# Altium schematic sheet LTC6804-2_8S+TR.SchDoc
size A4; SheetNumber: 5; SheetTotal: 8
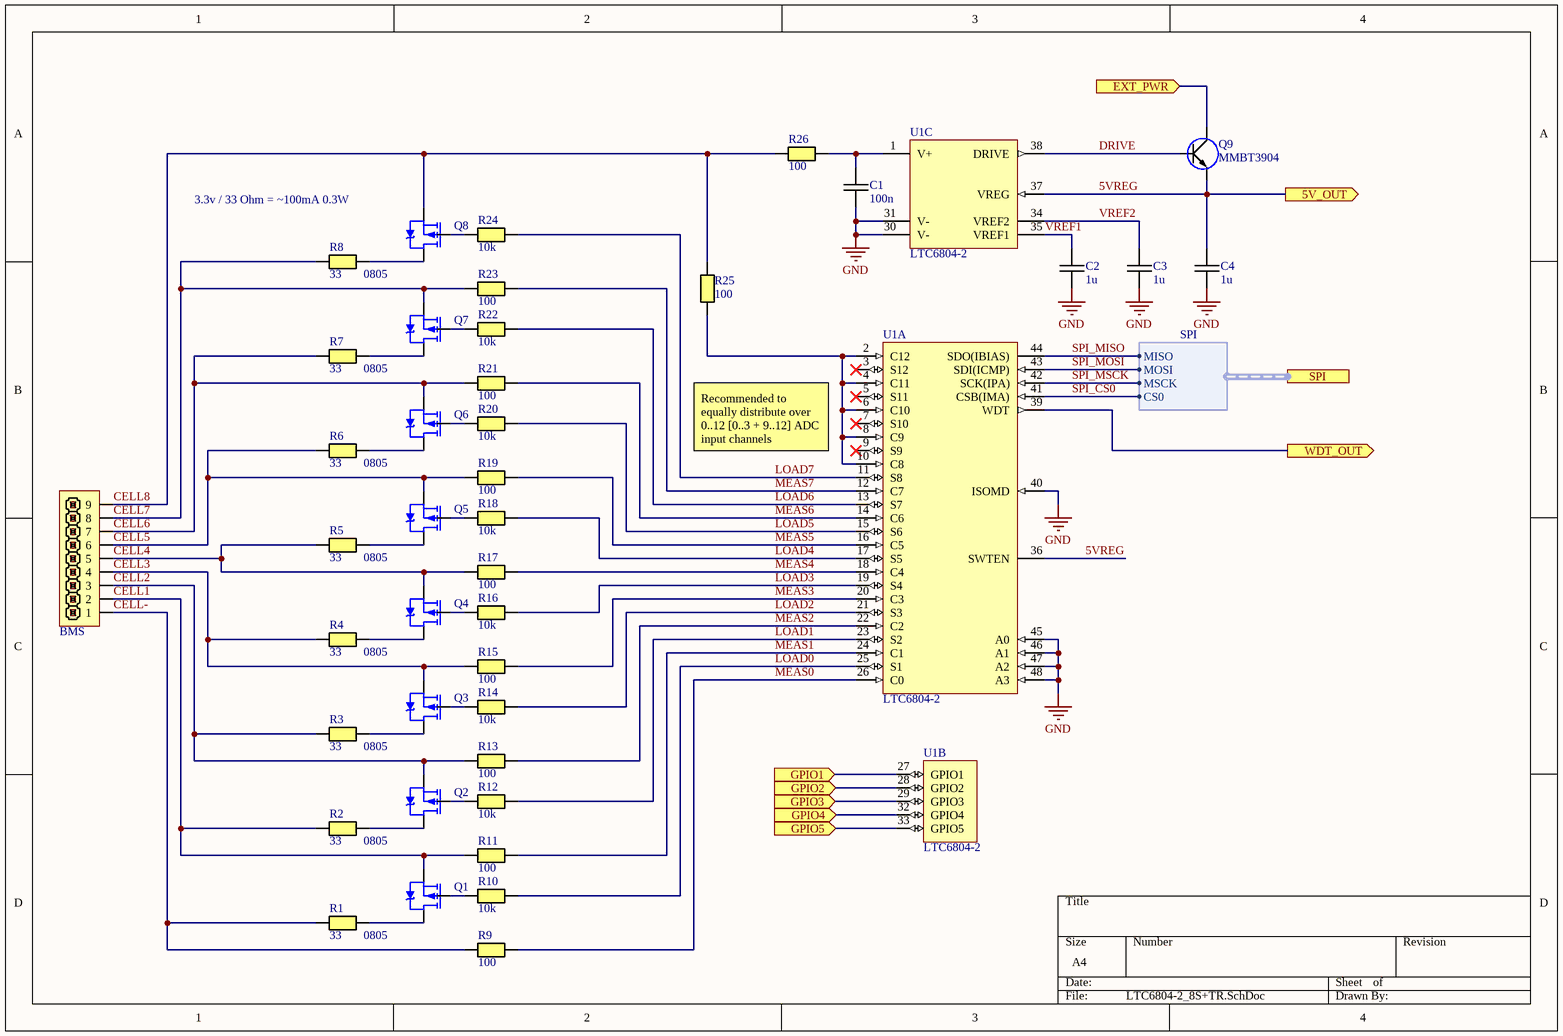
[diagram p0: LTC6804-2_8S+TR.SchDoc]

## Parts
BMS  PIN HEADER 1x9  [XH2.54 9P]  (value not drawn)
C1  100n  [CAPC0603(1608)55_N]
C2  1u  [CAPC0805(2012)75_N]
C3  1u  [CAPC0805(2012)75_N]
C4  1u  [CAPC0805(2012)75_N]
Q1  BSS308PE  [SOT23]  (value not drawn)
Q2  BSS308PE  [SOT23]  (value not drawn)
Q3  BSS308PE  [SOT23]  (value not drawn)
Q4  BSS308PE  [SOT23]  (value not drawn)
Q5  BSS308PE  [SOT23]  (value not drawn)
Q6  BSS308PE  [SOT23]  (value not drawn)
Q7  BSS308PE  [SOT23]  (value not drawn)
Q8  BSS308PE  [SOT23]  (value not drawn)
Q9  MMBT3904  [SOT23]
R1  pack: 0805  [RESC0805(2012)_N]  (hidden comment: 33)
R2  pack: 0805  [RESC0805(2012)_N]  (hidden comment: 33)
R3  pack: 0805  [RESC0805(2012)_N]  (hidden comment: 33)
R4  pack: 0805  [RESC0805(2012)_N]  (hidden comment: 33)
R5  pack: 0805  [RESC0805(2012)_N]  (hidden comment: 33)
R6  pack: 0805  [RESC0805(2012)_N]  (hidden comment: 33)
R7  pack: 0805  [RESC0805(2012)_N]  (hidden comment: 33)
R8  pack: 0805  [RESC0805(2012)_N]  (hidden comment: 33)
R9  100  [RESC0603(1608)_N]
R10  10k  [RESC0603(1608)_N]
R11  100  [RESC0603(1608)_N]
R12  10k  [RESC0603(1608)_N]
R13  100  [RESC0603(1608)_N]
R14  10k  [RESC0603(1608)_N]
R15  100  [RESC0603(1608)_N]
R16  10k  [RESC0603(1608)_N]
R17  100  [RESC0603(1608)_N]
R18  10k  [RESC0603(1608)_N]
R19  100  [RESC0603(1608)_N]
R20  10k  [RESC0603(1608)_N]
R21  100  [RESC0603(1608)_N]
R22  10k  [RESC0603(1608)_N]
R23  100  [RESC0603(1608)_N]
R24  10k  [RESC0603(1608)_N]
R25  100  [RESC0603(1608)_N]
R26  100  [RESC0603(1608)_N]
U1  LTC6804-2  [SSOP48]  (parts A,B,C of 3)

## Ports
5V_OUT (out), EXT_PWR (in), GPIO1 (in), GPIO2 (in), GPIO3 (in), GPIO4 (in), GPIO5 (in), SPI (harness SPI), WDT_OUT (out)

## Harnesses
SPI: MSCK, MOSI, MISO, CS0

## Nets
GND: C1.2 C2.2 C3.2 C4.2 U1.30(V-) U1.31(V-) U1.40(ISOMD) U1.45(A0) U1.46(A1) U1.47(A2) U1.48(A3)
5VREG: C4.1 Q9.2(E) U1.36(SWTEN) U1.37(VREG) ; port 5V_OUT
CELL1: BMS.2 Q1.2 R2.1 R11.1
CELL2: BMS.3 Q2.2 R3.1 R13.1
CELL3: BMS.4 Q3.2 R4.1 R15.1
CELL4: BMS.5 Q4.2 R5.1 R17.1
CELL5: BMS.6 Q5.2 R6.1 R19.1
CELL6: BMS.7 Q6.2 R7.1 R21.1
CELL7: BMS.8 Q7.2 R8.1 R23.1
CELL8: BMS.9 Q8.2 R25.1 R26.1
CELL-: BMS.1 R1.1 R9.1
DRIVE: Q9.1(B) U1.38(DRIVE)
EXT_PWR: Q9.3(C) ; port EXT_PWR
GPIO1: U1.27(GPIO1) ; port GPIO1
GPIO2: U1.28(GPIO2) ; port GPIO2
GPIO3: U1.29(GPIO3) ; port GPIO3
GPIO4: U1.32(GPIO4) ; port GPIO4
GPIO5: U1.33(GPIO5) ; port GPIO5
LOAD0: R10.2 U1.25(S1)
LOAD1: R12.2 U1.23(S2)
LOAD2: R14.2 U1.21(S3)
LOAD3: R16.2 U1.19(S4)
LOAD4: R18.2 U1.17(S5)
LOAD5: R20.2 U1.15(S6)
LOAD6: R22.2 U1.13(S7)
LOAD7: R24.2 U1.11(S8)
MEAS0: R9.2 U1.26(C0)
MEAS1: R11.2 U1.24(C1)
MEAS2: R13.2 U1.22(C2)
MEAS3: R15.2 U1.20(C3)
MEAS4: R17.2 U1.18(C4)
MEAS5: R19.2 U1.16(C5)
MEAS6: R21.2 U1.14(C6)
MEAS7: R23.2 U1.12(C7)
SPI_CS0: U1.41(CSB(IMA)) ; port SPI.CS0
SPI_MISO: U1.44(SDO(IBIAS)) ; port SPI.MISO
SPI_MOSI: U1.43(SDI(ICMP)) ; port SPI.MOSI
SPI_MSCK: U1.42(SCK(IPA)) ; port SPI.MSCK
VREF1: C2.1 U1.35(VREF1)
VREF2: C3.1 U1.34(VREF2)
WDT_OUT: U1.39(WDT) ; port WDT_OUT
NetC1_1: C1.1 R26.2 U1.1(V+)
NetQ1_1: Q1.1 R10.1
NetQ1_3: Q1.3 R1.2
NetQ2_1: Q2.1 R12.1
NetQ2_3: Q2.3 R2.2
NetQ3_1: Q3.1 R14.1
NetQ3_3: Q3.3 R3.2
NetQ4_1: Q4.1 R16.1
NetQ4_3: Q4.3 R4.2
NetQ5_1: Q5.1 R18.1
NetQ5_3: Q5.3 R5.2
NetQ6_1: Q6.1 R20.1
NetQ6_3: Q6.3 R6.2
NetQ7_1: Q7.1 R22.1
NetQ7_3: Q7.3 R7.2
NetQ8_1: Q8.1 R24.1
NetQ8_3: Q8.3 R8.2
NetR25_2: R25.2 U1.2(C12) U1.4(C11) U1.6(C10) U1.8(C9) U1.10(C8)

Not connected (* = marked no-connect by the designer): U1 3(S12)* 5(S11)* 7(S10)* 9(S9)*

## Notes on the sheet
- 3.3v / 33 Ohm = ~100mA 0.3W
- Recommended to equally distribute over 0..12 [0..3 + 9..12] ADC input channels

## Library data of the parts
BMS = PIN HEADER 2.54 1x9
C1-C4 = Capacitor M: Ceramic capacitor Medium density
  C1: Value: 100n
  C2-C4: Value: 1u
Q1-Q8 = BSS308PE: OptiMOS™ P3 Small-Signal-Transistor; Vds: -30V; Rds: 80mOhm; Id: -2A
Q9 = 2N3904: NPN General Purpose Transistor; Collector-Emitter Voltage: 40V; Collector-Base Voltage: 60V; Collector Current - Continuous: 200mA; DC Current Gain: 300
R1-R26 = Resistor M: Resistor Medium Density
  R1-R8: Value: 33
  R9 R11 R13 R15 R17 R19 R21 R23 R25 R26: Value: 100
  R10 R12 R14 R16 R18 R20 R22 R24: Value: 10k
U1 = LTC6804-2: The LTC®6804 is a 3rd generation multicell battery stack / monitor that measures up to 12 series connected battery / cells with a total measurement error of less than 1.2mV. The / cell measurement range of 0V to 5V makes the LTC6804 / suitable for most battery chemistries. All 12 cell voltages / can be captured in 290µs, and lower data acquisition rates / can be selected for high noise reduction.